# EAGLE schematic grbl_shield (EAGLE 8.7.1)
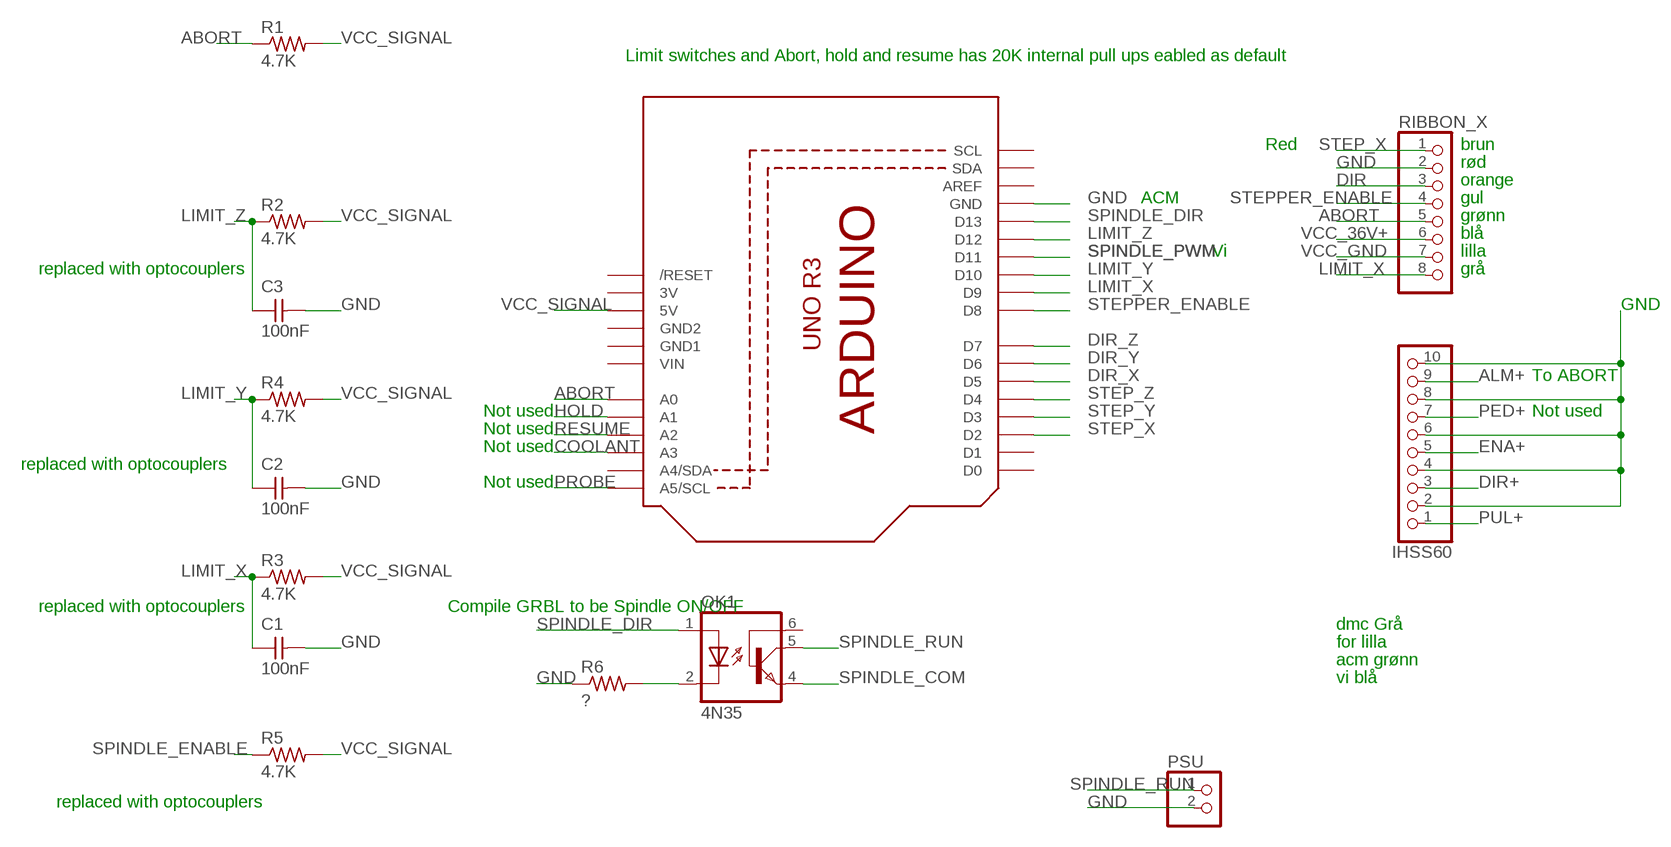
[diagram p0: schematic, sheet 1]

## Parts
C1  100nF  CAP-UNPOLARIZEDFAB  [C1206FAB]
C2  100nF  CAP-UNPOLARIZEDFAB  [C1206FAB]
C3  100nF  CAP-UNPOLARIZEDFAB  [C1206FAB]
IHSS60  PINHD-1X10  [1X10]
OK1  4N35  [DIL06]
PSU  PINHD-1X2  [1X02]
Q1  ARDUINOR3-NOIOREF-NOTEXT  [ARDUINOR3-NOTEXT-NOIOREF]
R1  4.7K  RES-US1206FAB  [R1206FAB]
R2  4.7K  RES-US1206FAB  [R1206FAB]
R3  4.7K  RES-US1206FAB  [R1206FAB]
R4  4.7K  RES-US1206FAB  [R1206FAB]
R5  4.7K  RES-US1206FAB  [R1206FAB]
R6  ?  RES-US1206FAB  [R1206FAB]
RIBBON_X  PINHD-1X8  [1X08]

## Nets
ABORT: Q1.A0 R1.1 RIBBON_X.5
ALM+: IHSS60.9
COOLANT: Q1.A3
DIR: RIBBON_X.3
DIR+: IHSS60.3
DIR_X: Q1.D5
DIR_Y: Q1.D6
DIR_Z: Q1.D7
ENA+: IHSS60.5
GND: C1.2 C2.2 C3.2 PSU.2 Q1.GND R6.1 RIBBON_X.2
HOLD: Q1.A1
LIMIT_X: C1.1 Q1.D9 R3.1 RIBBON_X.8
LIMIT_Y: C2.1 Q1.D10 R4.1
LIMIT_Z: C3.1 Q1.D12 R2.1
N$1: OK1.2(C) R6.2
N$14: IHSS60.2 IHSS60.4 IHSS60.6 IHSS60.8 IHSS60.10
PED+: IHSS60.7
PROBE: Q1.A5(A5/SCL)
PUL+: IHSS60.1
RESUME: Q1.A2
SPINDLE_COM: OK1.4(EMI)
SPINDLE_DIR: OK1.1(A) Q1.D13
SPINDLE_ENABLE: R5.1
SPINDLE_PWM: Q1.D11
SPINDLE_RUN: OK1.5(COL) PSU.1
STEP_X: Q1.D2 RIBBON_X.1
STEP_Y: Q1.D3
STEP_Z: Q1.D4
STEPPER_ENABLE: Q1.D8 RIBBON_X.4
VCC_36V+: RIBBON_X.6
VCC_GND: RIBBON_X.7
VCC_SIGNAL: Q1.5V R1.2 R2.2 R3.2 R4.2 R5.2
Unconnected: OK1.6(BAS) Q1.A4(A4/SDA) Q1.AREF Q1.D0 Q1.D1 Q1.RESET(/RESET) Q1.SCL Q1.SDA

## Notes on the sheet
- Limit switches and Abort, hold and resume has 20K internal pull ups eabled as default
- Red | brun
- rød
- orange
- ACM | gul
- grønn
- blå
- Vi | lilla
- replaced with optocouplers | grå
- GND
- To ABORT
- Not used | Not used
- Not used
- Not used
- replaced with optocouplers
- Not used
- replaced with optocouplers | Compile GRBL to be Spindle ON/OFF
- dmc Grå
- for lilla
- acm grønn
- vi blå
- replaced with optocouplers

## Power pins joined to a net without a drawn wire
3V: Q1.3V
GND1: Q1.GND1
GND2: Q1.GND2
VIN: Q1.VIN

## Library data of the parts
C1-C3 = fab:CAP-UNPOLARIZED
IHSS60 = pinhead:PINHD-1X10: PIN HEADER
OK1 = optocoupler-2:4N35: MOTOROLA OPTO COUPLER
PSU = pinhead:PINHD-1X2: PIN HEADER
Q1 = adafruit:ARDUINOR3-NOIOREF
R1-R6 = fab:RES-US: Resistor (US Symbol) Variants with postfix FAB are widened to allow the routing of internal traces
RIBBON_X = pinhead:PINHD-1X8: PIN HEADER